# EAGLE schematic SpherebotShield (EAGLE 7.7.0)
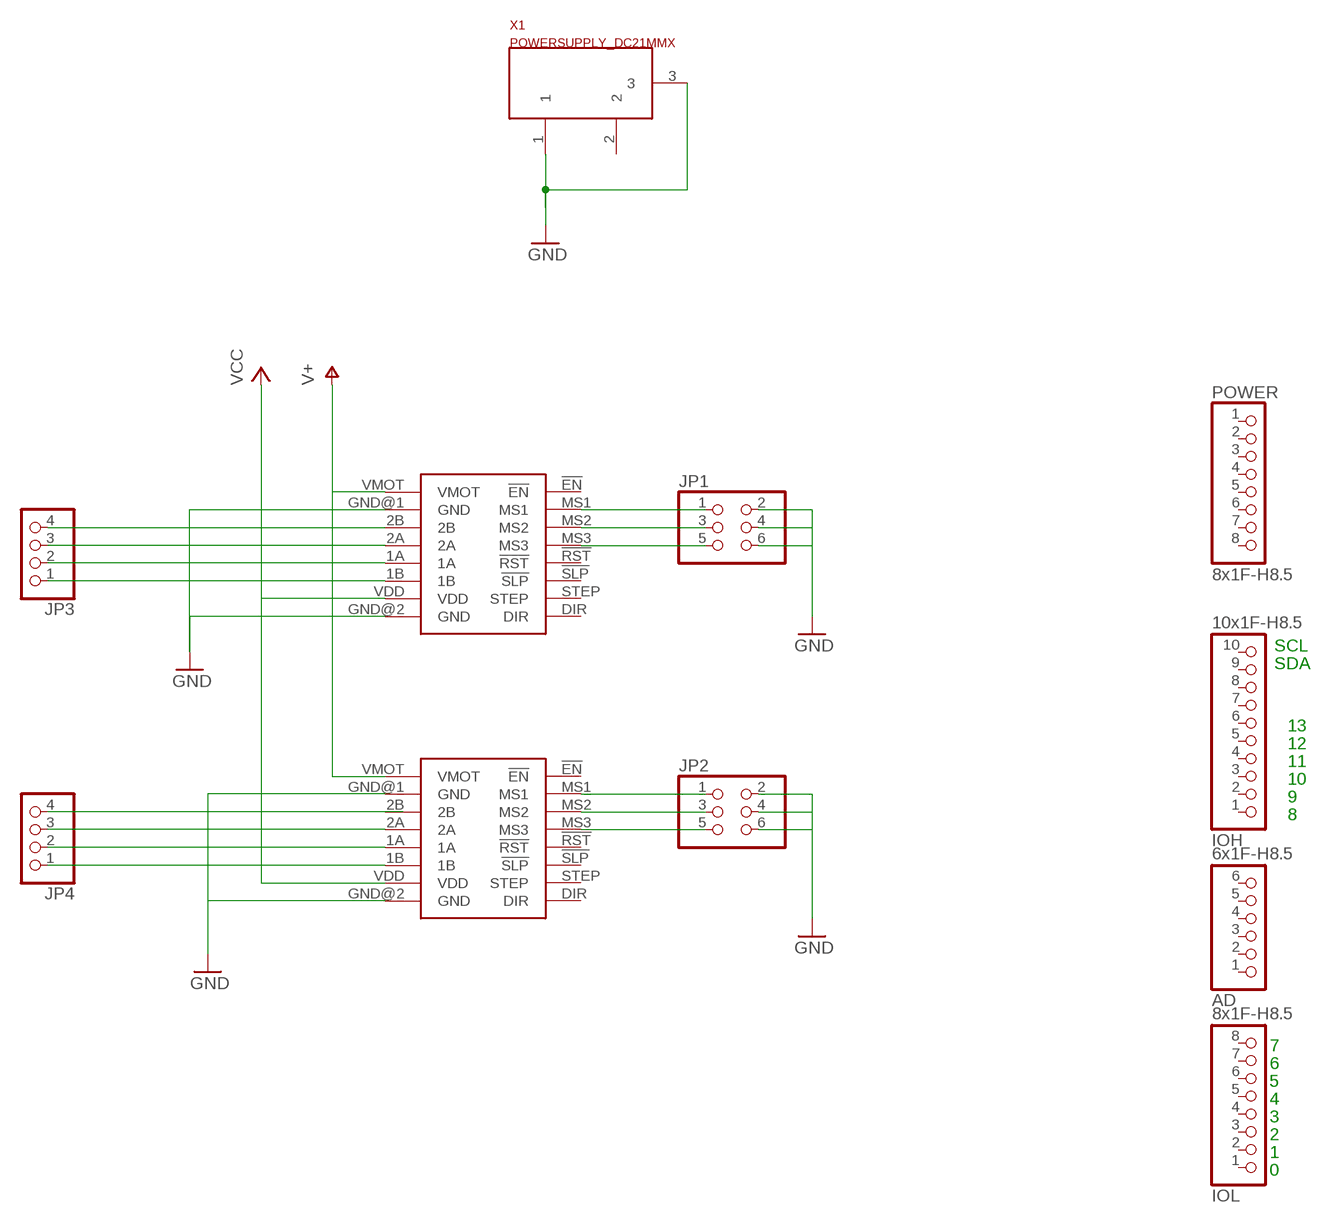
[diagram p0: schematic, sheet 1]

## Parts
AD  6x1F-H8.5  PINHD-1X6  [1X06]
IOH  10x1F-H8.5  PINHD-1X10_ARD  [1X10]
IOL  8x1F-H8.5  PINHD-1X8  [1X08]
JP1  PINHD-2X3  [2X03]
JP2  PINHD-2X3  [2X03]
JP3  PINHD-1X4  [1X04]
JP4  PINHD-1X4  [1X04]
POWER  8x1F-H8.5  PINHD-1X8  [1X08]
U$1  STEPSTICK  [STEPSTICK]
U$2  STEPSTICK  [STEPSTICK]
X1  POWERSUPPLY_DC21MMX  [POWERSUPPLY_DC-21MM]

## Nets
GND [gnd]: JP1.2 JP1.4 JP1.6 JP2.2 JP2.4 JP2.6 U$1.GND@1(GND) U$1.GND@2(GND) U$2.GND@1(GND) U$2.GND@2(GND) X1.1 X1.3
N$1: JP1.1 U$1.MS1
N$2: JP1.3 U$1.MS2
N$3: JP1.5 U$1.MS3
N$4: JP2.1 U$2.MS1
N$5: JP2.3 U$2.MS2
N$6: JP2.5 U$2.MS3
N$7: JP3.4 U$1.2B
N$8: JP3.3 U$1.2A
N$9: JP3.2 U$1.1A
N$10: JP3.1 U$1.1B
N$11: JP4.4
N$12: JP4.3 U$2.2A
N$13: JP4.2 U$2.1A
N$14: JP4.1 U$2.1B
V+: U$1.VMOT U$2.VMOT
VCC: U$1.VDD U$2.VDD
Unconnected: AD.1 AD.2 AD.3 AD.4 AD.5 AD.6 IOH.1 IOH.2 IOH.3 IOH.4 IOH.5 IOH.6 IOH.7 IOH.8 IOH.9 IOH.10 IOL.1 IOL.2 IOL.3 IOL.4 IOL.5 IOL.6 IOL.7 IOL.8 POWER.1 POWER.2 POWER.3 POWER.4 POWER.5 POWER.6 POWER.7 POWER.8 U$1.!EN U$1.!RST U$1.!SLP U$1.DIR U$1.STEP U$2.2B U$2.!EN U$2.!RST U$2.!SLP U$2.DIR U$2.STEP

## Notes on the sheet
- SCL
- SDA
- 13
- 12
- 11
- 10
- 9
- 8
- 7
- 6
- 5
- 4
- 3
- 2
- 1
- 0

## Power pins joined to a net without a drawn wire
2: X1.2

## Library data of the parts
AD = SmartPrj:PINHD-1X6: PIN HEADER
IOH = SmartPrj:PINHD-1X10_ARD: PIN HEADER
IOL POWER = SmartPrj:PINHD-1X8: PIN HEADER
JP1 JP2 = pinhead:PINHD-2X3: PIN HEADER
JP3 JP4 = pinhead:PINHD-1X4: PIN HEADER
U$1 U$2 = JKE-StepStick:STEPSTICK
X1 = SmartPrj:POWERSUPPLY_DC21MM

## Net classes
0 default: width 0.254 mm, clearance 0.254 mm
1 power: width 0.61 mm, drill 0.61 mm, clearance 0.254 mm
2 gnd: width 0.305 mm, drill 0.559 mm, clearance 0.254 mm
3 usbvcc: width 0.508 mm, drill 0.61 mm, clearance 0.254 mm
4 aref: width 0.406 mm, drill 0.61 mm, clearance 0.254 mm